# Altium schematic sheet Y1BVER2.0_2.SchDoc
size A3
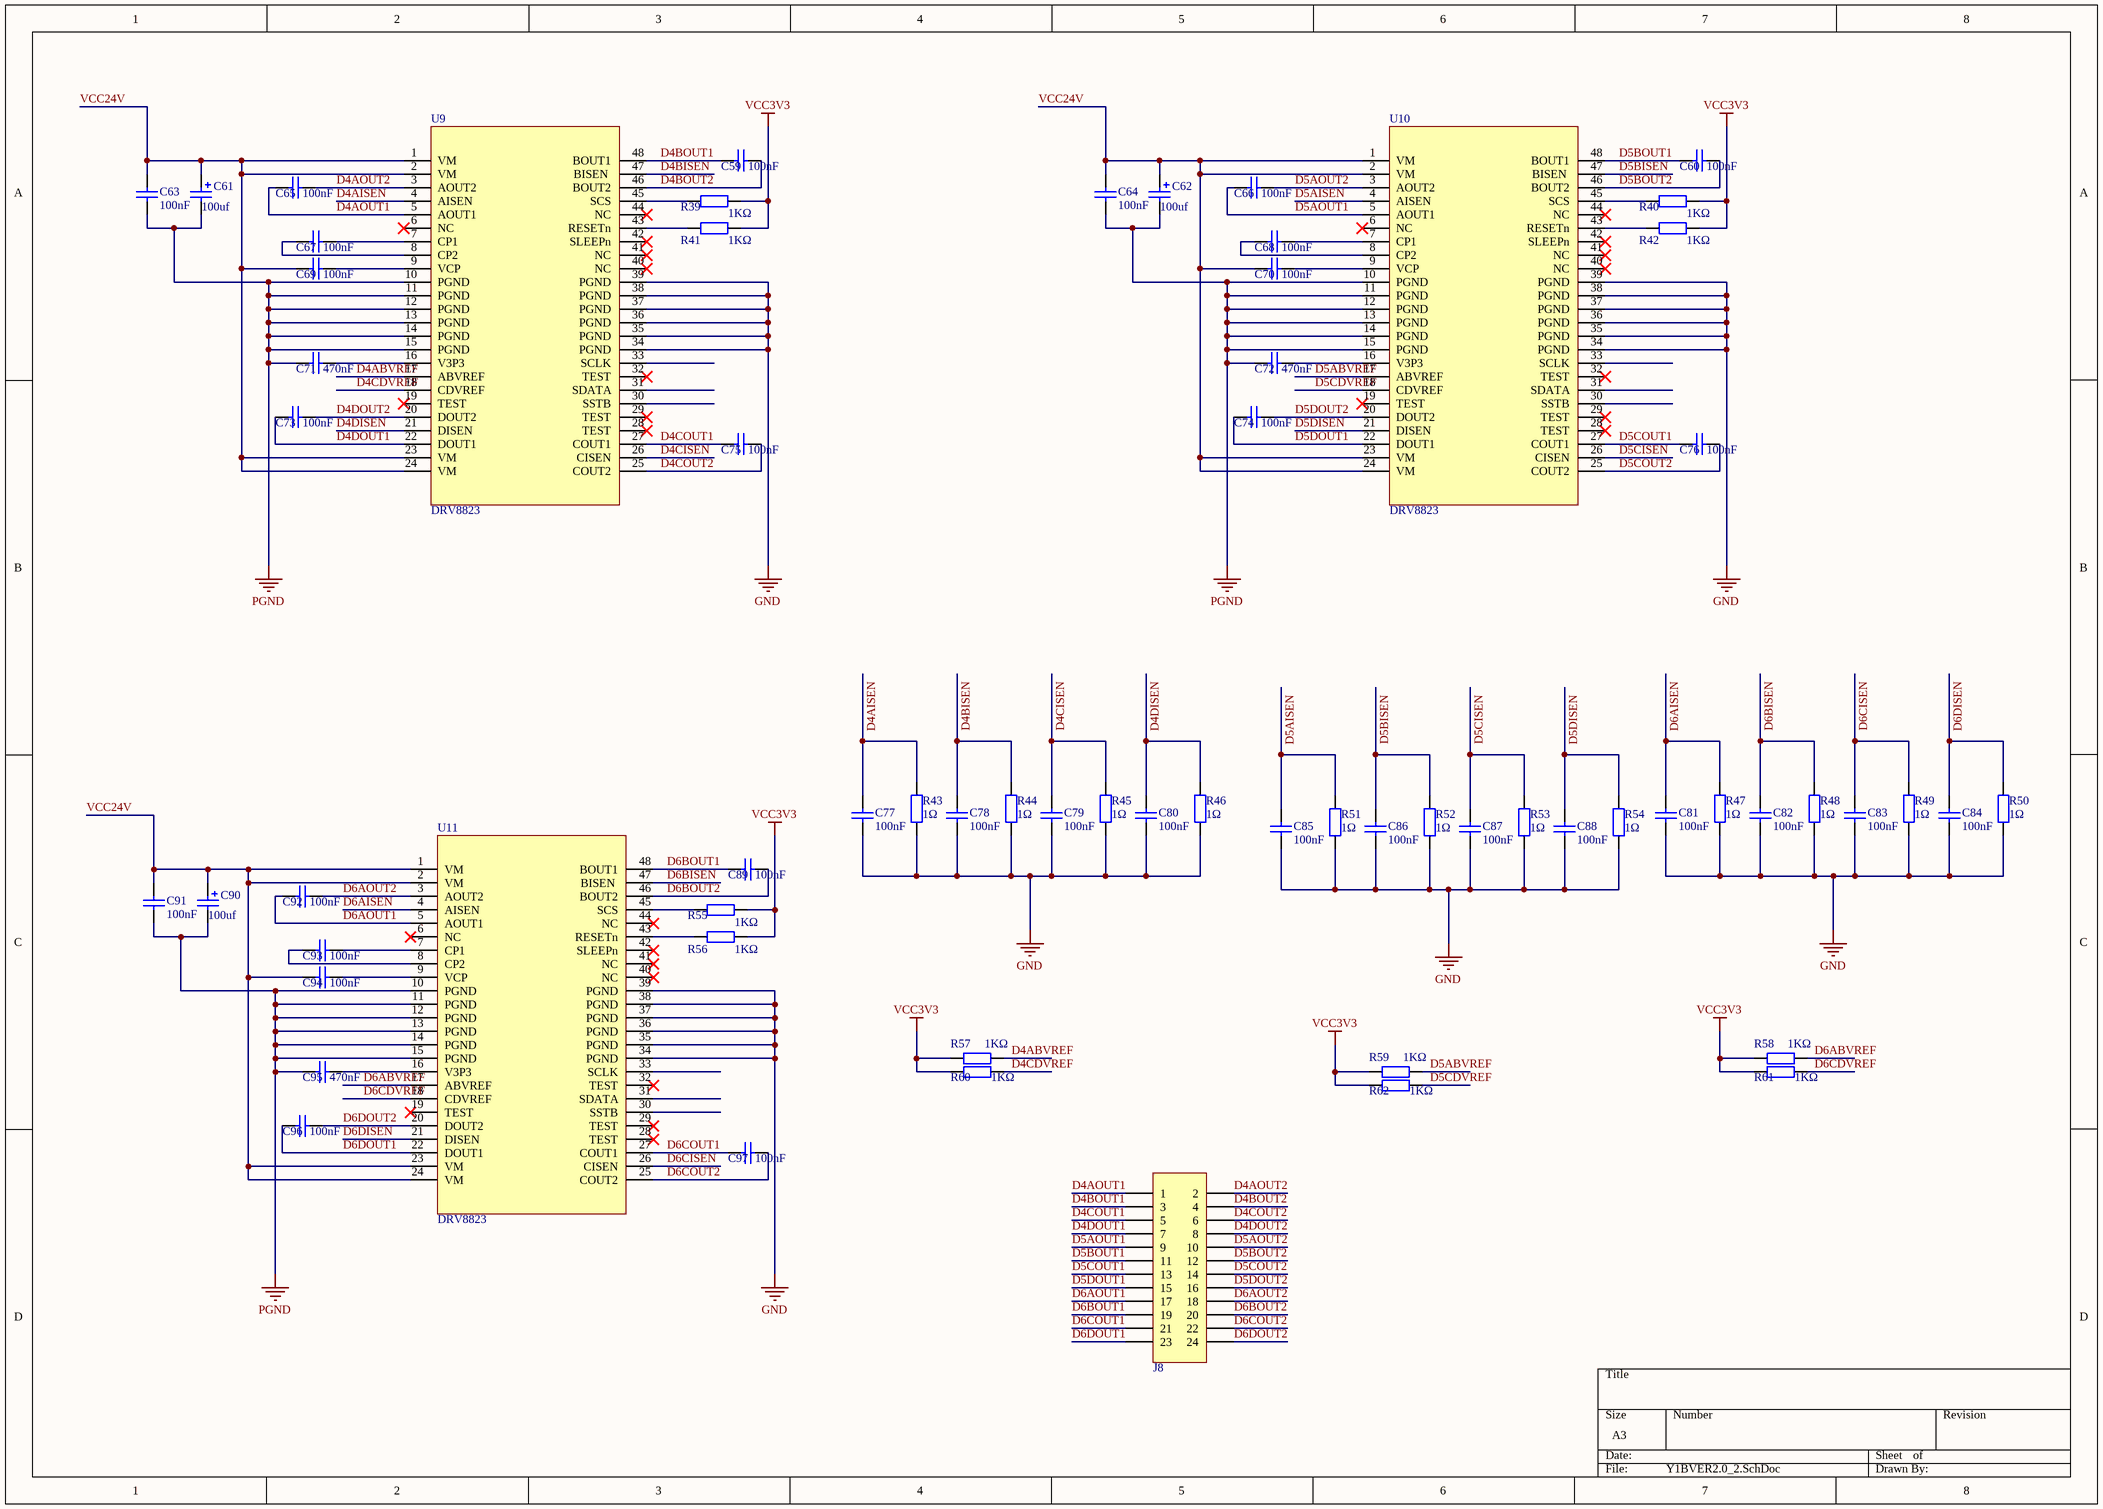
[diagram p0: Y1BVER2.0_2.SchDoc]

## Parts
C59  100nF  [0603_C]
C60  100nF  [0603_C]
C61  100uf  [E_6.3*5.4]
C62  100uf  [E_6.3*5.4]
C63  100nF  [0603_C]
C64  100nF  [0603_C]
C65  100nF  [0603_C]
C66  100nF  [0603_C]
C67  100nF  [0603_C]
C68  100nF  [0603_C]
C69  100nF  [0603_C]
C70  100nF  [0603_C]
C71  470nF  [0603_C]
C72  470nF  [0603_C]
C73  100nF  [0603_C]
C74  100nF  [0603_C]
C75  100nF  [0603_C]
C76  100nF  [0603_C]
C77  100nF  [0603_C]
C78  100nF  [0603_C]
C79  100nF  [0603_C]
C80  100nF  [0603_C]
C81  100nF  [0603_C]
C82  100nF  [0603_C]
C83  100nF  [0603_C]
C84  100nF  [0603_C]
C85  100nF  [0603_C]
C86  100nF  [0603_C]
C87  100nF  [0603_C]
C88  100nF  [0603_C]
C89  100nF  [0603_C]
C90  100uf  [E_6.3*5.4]
C91  100nF  [0603_C]
C92  100nF  [0603_C]
C93  100nF  [0603_C]
C94  100nF  [0603_C]
C95  470nF  [0603_C]
C96  100nF  [0603_C]
C97  100nF  [0603_C]
J8  header24p  [5557-2*12P]  (value not drawn)
R39  1KΩ  [0603_R]
R40  1KΩ  [0603_R]
R41  1KΩ  [0603_R]
R42  1KΩ  [0603_R]
R43  1Ω  [0603_R]
R44  1Ω  [0603_R]
R45  1Ω  [0603_R]
R46  1Ω  [0603_R]
R47  1Ω  [0603_R]
R48  1Ω  [0603_R]
R49  1Ω  [0603_R]
R50  1Ω  [0603_R]
R51  1Ω  [0603_R]
R52  1Ω  [0603_R]
R53  1Ω  [0603_R]
R54  1Ω  [0603_R]
R55  1KΩ  [0603_R]
R56  1KΩ  [0603_R]
R57  1KΩ  [0603_R]
R58  1KΩ  [0603_R]
R59  1KΩ  [0603_R]
R60  1KΩ  [0603_R]
R61  1KΩ  [0603_R]
R62  1KΩ  [0603_R]
U9  DRV8823  [HTSSOP-48]
U10  DRV8823  [HTSSOP-48]
U11  DRV8823  [HTSSOP-48]

## Nets
GND: C77.1 C78.1 C79.1 C80.1 C81.1 C82.1 C83.1 C84.1 C85.1 C86.1 C87.1 C88.1 R43.1 R44.1 R45.1 R46.1 R47.1 R48.1 R49.1 R50.1 R51.1 R52.1 R53.1 R54.1 U9.34(PGND) U9.35(PGND) U9.36(PGND) U9.37(PGND) U9.38(PGND) U9.39(PGND) U10.34(PGND) U10.35(PGND) U10.36(PGND) U10.37(PGND) U10.38(PGND) U10.39(PGND) U11.34(PGND) U11.35(PGND) U11.36(PGND) U11.37(PGND) U11.38(PGND) U11.39(PGND)
PGND: C61.2 C62.2 C63.1 C64.1 C71.1 C72.1 C90.2 C91.1 C95.1 U9.10(PGND) U9.11(PGND) U9.12(PGND) U9.13(PGND) U9.14(PGND) U9.15(PGND) U10.10(PGND) U10.11(PGND) U10.12(PGND) U10.13(PGND) U10.14(PGND) U10.15(PGND) U11.10(PGND) U11.11(PGND) U11.12(PGND) U11.13(PGND) U11.14(PGND) U11.15(PGND)
VCC3V3: R39.2 R40.2 R41.2 R42.2 R55.2 R56.2 R57.1 R58.1 R59.1 R60.1 R61.1 R62.1
D4ABVREF: R57.2 U9.17(ABVREF)
D4AISEN: C77.2 R43.2 U9.4(AISEN)
D4AOUT1: C65.1 J8.1 U9.5(AOUT1)
D4AOUT2: C65.2 J8.2 U9.3(AOUT2)
D4BISEN: C78.2 R44.2 U9.47(BISEN)
D4BOUT1: C59.1 J8.3 U9.48(BOUT1)
D4BOUT2: C59.2 J8.4 U9.46(BOUT2)
D4CDVREF: R60.2 U9.18(CDVREF)
D4CISEN: C79.2 R45.2 U9.26(CISEN)
D4COUT1: C75.1 J8.5 U9.27(COUT1)
D4COUT2: C75.2 J8.6 U9.25(COUT2)
D4DISEN: C80.2 R46.2 U9.21(DISEN)
D4DOUT1: C73.1 J8.7 U9.22(DOUT1)
D4DOUT2: C73.2 J8.8 U9.20(DOUT2)
D5ABVREF: R59.2 U10.17(ABVREF)
D5AISEN: C85.2 R51.2 U10.4(AISEN)
D5AOUT1: C66.1 J8.9 U10.5(AOUT1)
D5AOUT2: C66.2 J8.10 U10.3(AOUT2)
D5BISEN: C86.2 R52.2 U10.47(BISEN)
D5BOUT1: C60.1 J8.11 U10.48(BOUT1)
D5BOUT2: C60.2 J8.12 U10.46(BOUT2)
D5CDVREF: R62.2 U10.18(CDVREF)
D5CISEN: C87.2 R53.2 U10.26(CISEN)
D5COUT1: C76.1 J8.13 U10.27(COUT1)
D5COUT2: C76.2 J8.14 U10.25(COUT2)
D5DISEN: C88.2 R54.2 U10.21(DISEN)
D5DOUT1: C74.1 J8.15 U10.22(DOUT1)
D5DOUT2: C74.2 J8.16 U10.20(DOUT2)
D6ABVREF: R58.2 U11.17(ABVREF)
D6AISEN: C81.2 R47.2 U11.4(AISEN)
D6AOUT1: C92.1 J8.17 U11.5(AOUT1)
D6AOUT2: C92.2 J8.18 U11.3(AOUT2)
D6BISEN: C82.2 R48.2 U11.47(BISEN)
D6BOUT1: C89.1 J8.19 U11.48(BOUT1)
D6BOUT2: C89.2 J8.20 U11.46(BOUT2)
D6CDVREF: R61.2 U11.18(CDVREF)
D6CISEN: C83.2 R49.2 U11.26(CISEN)
D6COUT1: C97.1 J8.21 U11.27(COUT1)
D6COUT2: C97.2 J8.22 U11.25(COUT2)
D6DISEN: C84.2 R50.2 U11.21(DISEN)
D6DOUT1: C96.1 J8.23 U11.22(DOUT1)
D6DOUT2: C96.2 J8.24 U11.20(DOUT2)
VCC24V: C61.1 C62.1 C63.2 C64.2 C69.1 C70.1 C90.1 C91.2 C94.1 U9.1(VM) U9.2(VM) U9.23(VM) U9.24(VM) U10.1(VM) U10.2(VM) U10.23(VM) U10.24(VM) U11.1(VM) U11.2(VM) U11.23(VM) U11.24(VM)
NetC67_1: C67.1 U9.8(CP2)
NetC67_2: C67.2 U9.7(CP1)
NetC68_1: C68.1 U10.8(CP2)
NetC68_2: C68.2 U10.7(CP1)
NetC69_2: C69.2 U9.9(VCP)
NetC70_2: C70.2 U10.9(VCP)
NetC71_2: C71.2 U9.16(V3P3)
NetC72_2: C72.2 U10.16(V3P3)
NetC93_1: C93.1 U11.8(CP2)
NetC93_2: C93.2 U11.7(CP1)
NetC94_2: C94.2 U11.9(VCP)
NetC95_2: C95.2 U11.16(V3P3)
NetR39_1: R39.1 U9.45(SCS)
NetR40_1: R40.1 U10.45(SCS)
NetR41_1: R41.1 U9.43(RESETn)
NetR42_1: R42.1 U10.43(RESETn)
NetR55_1: R55.1 U11.45(SCS)
NetR56_1: R56.1 U11.43(RESETn)

Not connected (* = marked no-connect by the designer): U9 6(NC)* 19(TEST)* 28(TEST)* 29(TEST)* 30(SSTB) 31(SDATA) 32(TEST)* 33(SCLK) 40(NC)* 41(NC)* 42(SLEEPn)* 44(NC)*; U10 6(NC)* 19(TEST)* 28(TEST)* 29(TEST)* 30(SSTB) 31(SDATA) 32(TEST)* 33(SCLK) 40(NC)* 41(NC)* 42(SLEEPn)* 44(NC)*; U11 6(NC)* 19(TEST)* 28(TEST)* 29(TEST)* 30(SSTB) 31(SDATA) 32(TEST)* 33(SCLK) 40(NC)* 41(NC)* 42(SLEEPn)* 44(NC)*

## Library data of the parts
C59 C60 C63-C70 C73-C89 C91-C94 C96 C97 = 0603 100nF (104) 10% 50V: 贴片电容; ComponentLink1Description: 供应商链接; ComponentLink1URL: http://www.szlcsc.com/product/details_15331.html; Package: 0603; Supplier: LC; SuppliersPartNumber: C14663
C61 C62 C90 = C
C71 C72 C95 = 0603 470nF (474) 10% 25V: 贴片电容; ComponentLink1Description: 供应商链接; ComponentLink1URL: http://www.szlcsc.com/product/details_1975.html; Package: 0603; Supplier: LC; SuppliersPartNumber: C1623
R39-R42 R55-R62 = 0603 1KΩ (1001) 1%: 贴片电阻; ComponentLink1Description: 供应商链接; ComponentLink1URL: http://www.szlcsc.com/product/details_21904.html; Package: 0603; Supplier: LC; SuppliersPartNumber: C21190
R43-R54 = 0603 1Ω (1R00) 1%: 贴片电阻; ComponentLink1Description: 供应商链接; ComponentLink1URL: http://www.szlcsc.com/product/details_23663.html; Package: 0603; Supplier: LC; SuppliersPartNumber: C22936
U9-U11 = DRV8823: 4路BDC电机驱动